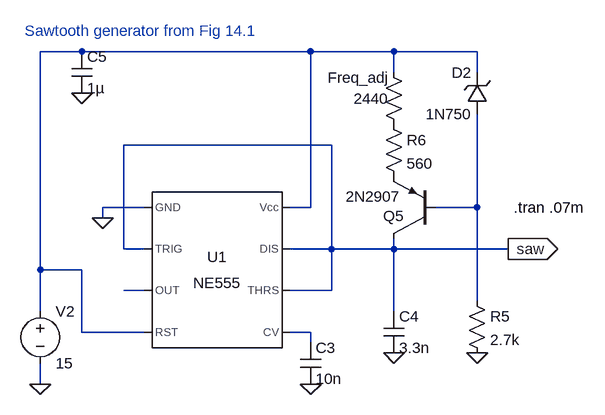
[diagram p0: schematic sawtooth.asc]
sawtooth.asc, the LTspice schematic file:
Version 4
SHEET 1 880 680
WIRE -176 -144 -240 -144
WIRE 176 -144 -176 -144
WIRE 304 -144 176 -144
WIRE 432 -144 304 -144
WIRE 304 -112 304 -144
WIRE 432 -112 432 -144
WIRE 208 0 -112 0
WIRE -80 96 -144 96
WIRE 176 96 176 -144
WIRE 176 96 144 96
WIRE 432 96 432 -48
WIRE 432 96 368 96
WIRE -144 112 -144 96
WIRE -112 160 -112 0
WIRE -80 160 -112 160
WIRE 208 160 208 0
WIRE 208 160 144 160
WIRE 304 160 304 144
WIRE 304 160 208 160
WIRE 480 160 304 160
WIRE -240 192 -240 -144
WIRE -176 192 -240 192
WIRE -80 224 -112 224
WIRE 208 224 208 160
WIRE 208 224 144 224
WIRE 432 240 432 96
WIRE -240 256 -240 192
WIRE 304 256 304 160
WIRE -176 288 -176 192
WIRE -80 288 -176 288
WIRE 176 288 144 288
WIRE 176 304 176 288
WIRE -240 368 -240 336
FLAG -240 368 0
FLAG -144 112 0
FLAG 176 368 0
FLAG 304 320 0
FLAG -176 -80 0
FLAG 432 320 0
FLAG 480 160 saw
IOPIN 480 160 Out
SYMBOL Misc\\NE555 32 192 R0
SYMATTR InstName U1
SYMBOL voltage -240 240 R0
WINDOW 123 0 0 Left 0
WINDOW 39 0 0 Left 0
SYMATTR InstName V2
SYMATTR Value 15
SYMBOL res 288 -48 R0
SYMATTR InstName R6
SYMATTR Value 560
SYMBOL pnp 368 144 R180
WINDOW 0 48 35 Left 2
WINDOW 3 53 65 Left 2
SYMATTR InstName Q5
SYMATTR Value 2N2907
SYMBOL zener 448 -48 R180
WINDOW 0 24 64 Left 2
WINDOW 3 24 0 Left 2
SYMATTR InstName D2
SYMATTR Value 1N750
SYMBOL cap 160 304 R0
SYMATTR InstName C3
SYMATTR Value 10n
SYMBOL res 416 224 R0
SYMATTR InstName R5
SYMATTR Value 2.7k
SYMBOL cap 288 256 R0
SYMATTR InstName C4
SYMATTR Value 3.3n
SYMBOL cap -192 -144 R0
SYMATTR InstName C5
SYMATTR Value 1µ
SYMBOL res 288 -128 R0
WINDOW 0 -86 24 Left 2
WINDOW 3 -46 56 Left 2
SYMATTR InstName Freq_adj
SYMATTR Value 2440
TEXT -264 -176 Left 2 ;Sawtooth generator from Fig 14.1
TEXT 488 96 Left 2 !.tran .07m

The netlist it stands for:
* sawtooth.asc
XU1 0 saw N003 N001 N004 saw saw N001 NE555  ; pins GND TRIG OUT RST CV THRS DIS Vcc
V2 N001 0 15
R6 P001 P002 560
Q5 saw N002 P002 0 2N2907
D2 N002 N001 1N750
C3 N004 0 10n
R5 N002 0 2.7k
C4 saw 0 3.3n
C5 N001 0 1µ
R§Freq_adj N001 P001 2440
.model D D
.lib standard.dio
.model NPN NPN
.model PNP PNP
.lib standard.bjt
* Sawtooth generator from Fig 14.1
.tran .07m
.lib NE555.sub
.backanno
.end